# Altium schematic sheet DC-DC.SchDoc
size A2
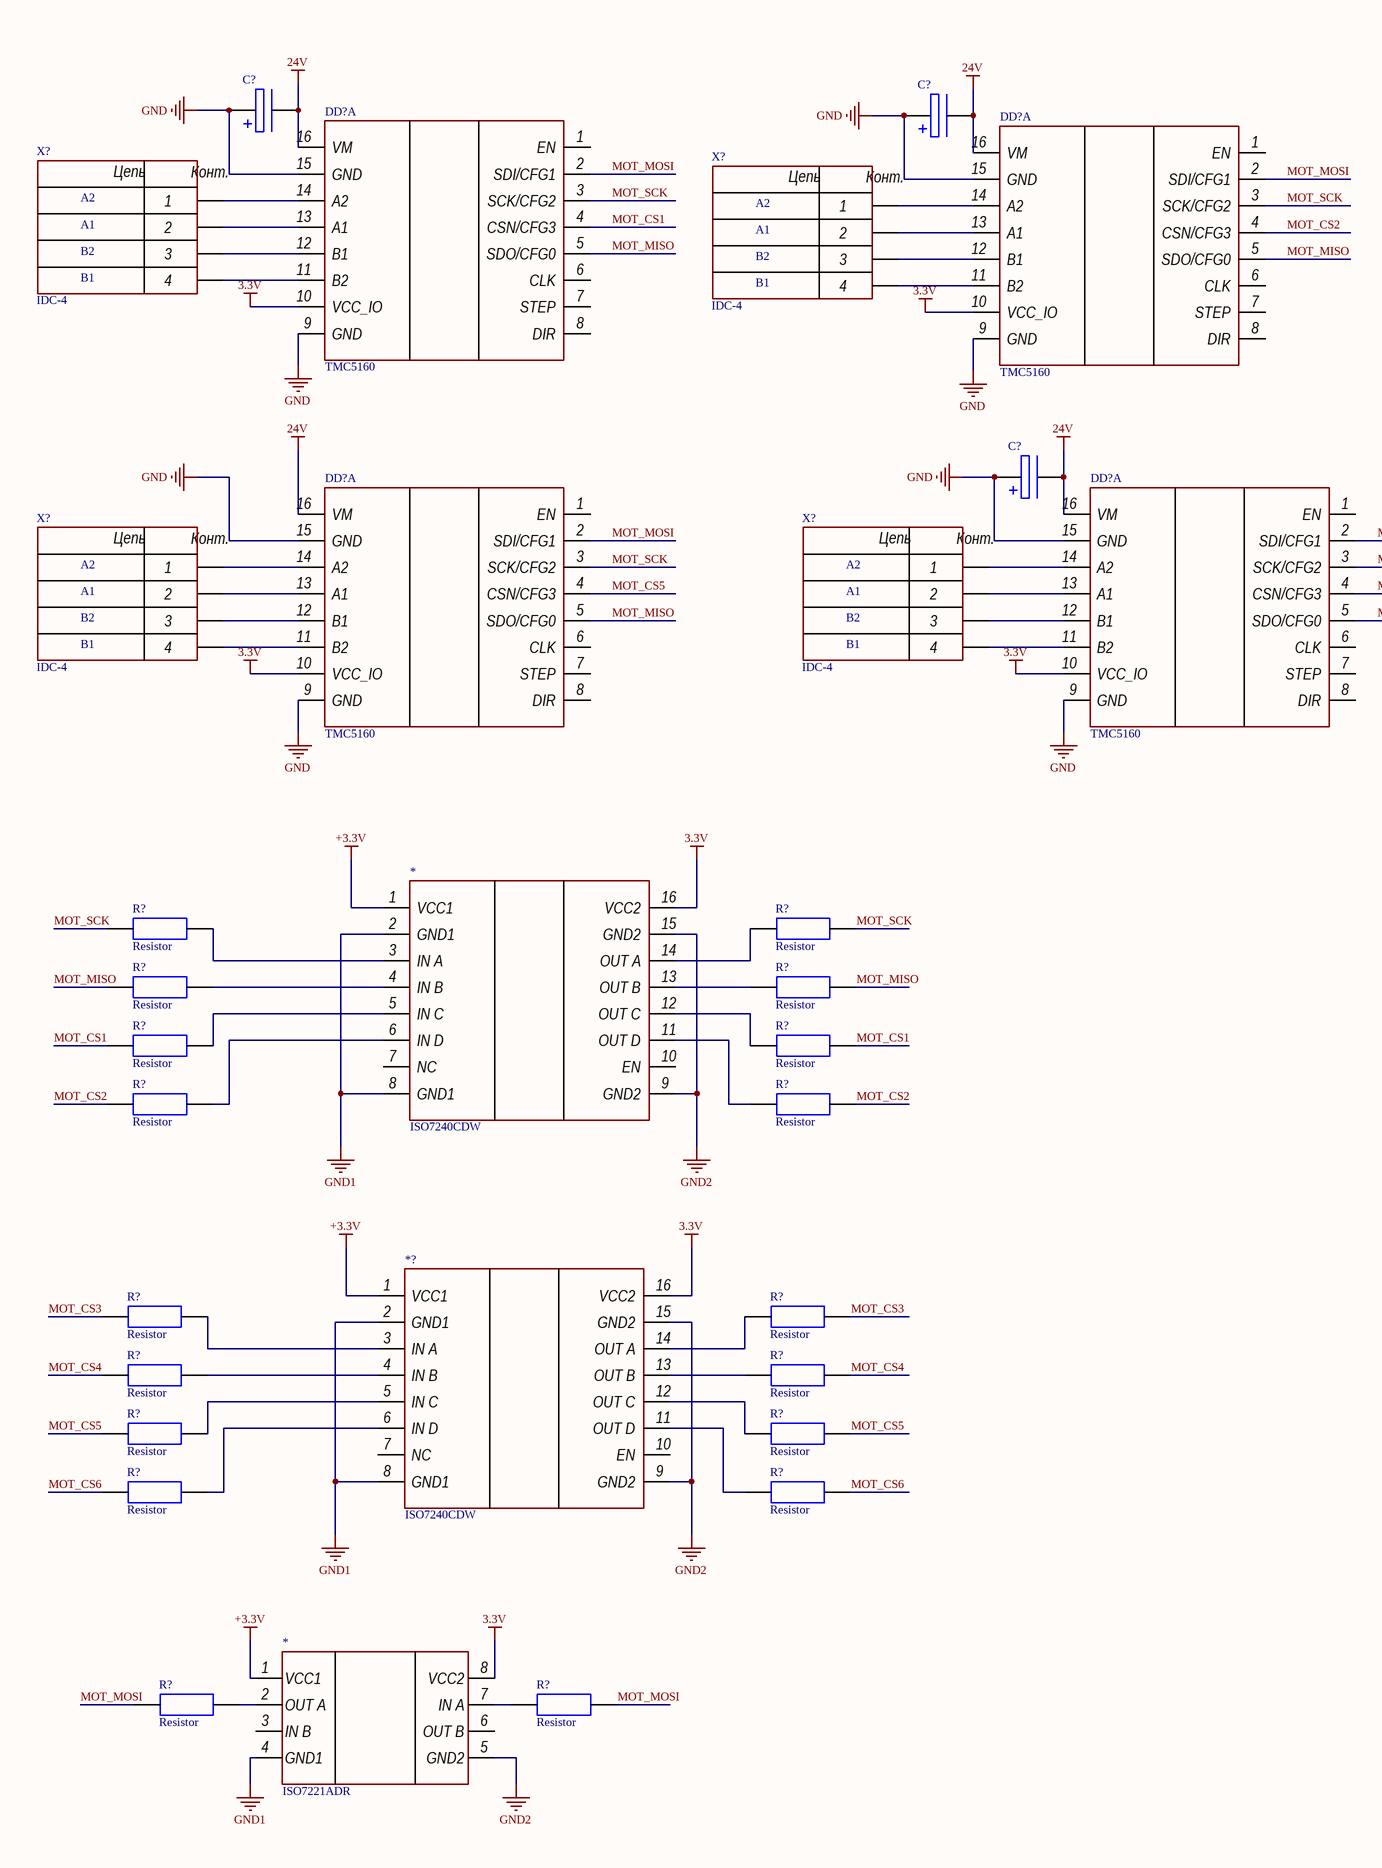
[diagram p0: DC-DC.SchDoc, left]
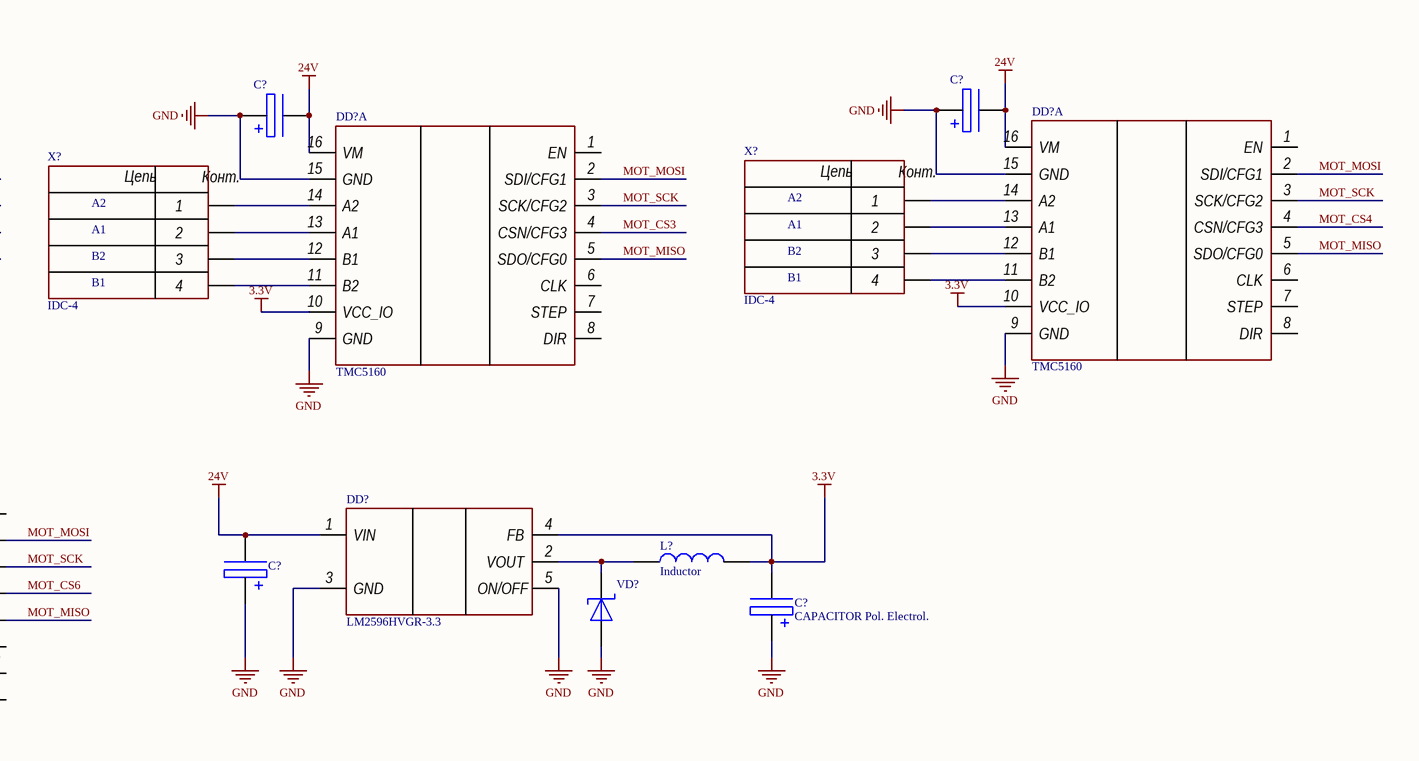
[diagram p1: DC-DC.SchDoc, right]

## Parts
(Parts that share a designator on the sheet are numbered #1, #2 ... from top to bottom, then left to right.)
*#1  ISO7240CDW  [ISO7240CDW_SOIC127P1030X265-16N]
*#2  ISO7221ADR  [ISO7221ADR_SOIC127P599X175-8N]
*?  ISO7240CDW  [ISO7240CDW_SOIC127P1030X265-16N]
C?#1  CAPACITOR Pol. Electrol.  (value not drawn)
C?#2  CAPACITOR Pol. Electrol.  (value not drawn)
C?#3  CAPACITOR Pol. Electrol.  (value not drawn)
C?#4  CAPACITOR Pol. Electrol.  (value not drawn)
C?#5  CAPACITOR Pol. Electrol.  (value not drawn)
C?#6  CAPACITOR Pol. Electrol.  (value not drawn)
C?#7  CAPACITOR Pol. Electrol.
DD?#1  TMC5160  [TMC5160]  (part A of 2)
DD?#2  TMC5160  [TMC5160]  (part A of 2)
DD?#3  TMC5160  [TMC5160]  (part A of 2)
DD?#4  TMC5160  [TMC5160]  (part A of 2)
DD?#5  TMC5160  [TMC5160]  (part A of 2)
DD?#6  TMC5160  [TMC5160]  (part A of 2)
DD?#7  LM2596HVGR-3.3
L?  Inductor  [IND_LQH66SN330M03L]
R?#1  Resistor  [RES: 0805]
R?#2  Resistor  [RES: 0805]
R?#3  Resistor  [RES: 0805]
R?#4  Resistor  [RES: 0805]
R?#5  Resistor  [RES: 0805]
R?#6  Resistor  [RES: 0805]
R?#7  Resistor  [RES: 0805]
R?#8  Resistor  [RES: 0805]
R?#9  Resistor  [RES: 0805]
R?#10  Resistor  [RES: 0805]
R?#11  Resistor  [RES: 0805]
R?#12  Resistor  [RES: 0805]
R?#13  Resistor  [RES: 0805]
R?#14  Resistor  [RES: 0805]
R?#15  Resistor  [RES: 0805]
R?#16  Resistor  [RES: 0805]
R?#17  Resistor  [RES: 0805]
R?#18  Resistor  [RES: 0805]
VD?  Diode_Shottki  [SK54]  (value not drawn)
X?#1  IDC-4
X?#2  IDC-4
X?#3  IDC-4
X?#4  IDC-4
X?#5  IDC-4
X?#6  IDC-4

## Nets
3.3V: *#1.16(VCC2) *#2.8(VCC2) *?.16(VCC2) C?#7.2(PIN_2) DD?#1.10(VCC_IO) DD?#2.10(VCC_IO) DD?#3.10(VCC_IO) DD?#4.10(VCC_IO) DD?#5.10(VCC_IO) DD?#6.10(VCC_IO) DD?#7.4(FB) L?.2
24V: C?#1.2(PIN_2) C?#2.2(PIN_2) C?#3.2(PIN_2) C?#4.2(PIN_2) C?#5.2(PIN_2) C?#6.2(PIN_2) DD?#1.16(VM) DD?#2.16(VM) DD?#3.16(VM) DD?#4.16(VM) DD?#5.16(VM) DD?#6.16(VM) DD?#7.1(VIN)
+3.3V: *#1.1(VCC1) *#2.1(VCC1) *?.1(VCC1)
GND: C?#1.1(PIN_1) C?#2.1(PIN_1) C?#3.1(PIN_1) C?#4.1(PIN_1) C?#5.1(PIN_1) C?#6.1(PIN_1) C?#7.1(PIN_1) DD?#1.9(GND) DD?#1.15(GND) DD?#2.9(GND) DD?#2.15(GND) DD?#3.9(GND) DD?#3.15(GND) DD?#4.9(GND) DD?#4.15(GND) DD?#5.9(GND) DD?#5.15(GND) DD?#6.9(GND) DD?#6.15(GND) DD?#7.3(GND) DD?#7.5(ON/OFF) VD?.1(A)
GND1: *#1.2(GND1) *#1.8(GND1) *#2.4(GND1) *?.2(GND1) *?.8(GND1)
GND2: *#1.9(GND2) *#1.15(GND2) *#2.5(GND2) *?.9(GND2) *?.15(GND2)
MOT_CS1: DD?#1.4(CSN/CFG3) R?#5.1 R?#6.2
MOT_CS2: DD?#3.4(CSN/CFG3) R?#7.1 R?#8.2
MOT_CS3: DD?#4.4(CSN/CFG3) R?#9.1 R?#10.2
MOT_CS4: DD?#2.4(CSN/CFG3) R?#11.1 R?#12.2
MOT_CS5: DD?#5.4(CSN/CFG3) R?#13.1 R?#14.2
MOT_CS6: DD?#6.4(CSN/CFG3) R?#15.1 R?#16.2
MOT_MISO: DD?#1.5(SDO/CFG0) DD?#2.5(SDO/CFG0) DD?#3.5(SDO/CFG0) DD?#4.5(SDO/CFG0) DD?#5.5(SDO/CFG0) DD?#6.5(SDO/CFG0) R?#3.1 R?#4.2
MOT_MOSI: DD?#1.2(SDI/CFG1) DD?#2.2(SDI/CFG1) DD?#3.2(SDI/CFG1) DD?#4.2(SDI/CFG1) DD?#5.2(SDI/CFG1) DD?#6.2(SDI/CFG1) R?#17.1 R?#18.2
MOT_SCK: DD?#1.3(SCK/CFG2) DD?#2.3(SCK/CFG2) DD?#3.3(SCK/CFG2) DD?#4.3(SCK/CFG2) DD?#5.3(SCK/CFG2) DD?#6.3(SCK/CFG2) R?#1.1 R?#2.2
Net*#1_3: *#1.3(IN_A) R?#1.2
Net*#1_4: *#1.4(IN_B) R?#3.2
Net*#1_5: *#1.5(IN_C) R?#5.2
Net*#1_6: *#1.6(IN_D) R?#7.2
Net*#1_11: *#1.11(OUT_D) R?#8.1
Net*#1_12: *#1.12(OUT_C) R?#6.1
Net*#1_13: *#1.13(OUT_B) R?#4.1
Net*#1_14: *#1.14(OUT_A) R?#2.1
Net*#2_2: *#2.2(OUT_A) R?#17.2
Net*#2_7: *#2.7(IN_A) R?#18.1
Net*?_3: *?.3(IN_A) R?#9.2
Net*?_4: *?.4(IN_B) R?#11.2
Net*?_5: *?.5(IN_C) R?#13.2
Net*?_6: *?.6(IN_D) R?#15.2
Net*?_11: *?.11(OUT_D) R?#16.1
Net*?_12: *?.12(OUT_C) R?#14.1
Net*?_13: *?.13(OUT_B) R?#12.1
Net*?_14: *?.14(OUT_A) R?#10.1
NetDD?#1_11: DD?#1.11(B2) X?#1.4
NetDD?#1_12: DD?#1.12(B1) X?#1.3
NetDD?#1_13: DD?#1.13(A1) X?#1.2
NetDD?#1_14: DD?#1.14(A2) X?#1.1
NetDD?#2_11: DD?#2.11(B2) X?#2.4
NetDD?#2_12: DD?#2.12(B1) X?#2.3
NetDD?#2_13: DD?#2.13(A1) X?#2.2
NetDD?#2_14: DD?#2.14(A2) X?#2.1
NetDD?#3_11: DD?#3.11(B2) X?#3.4
NetDD?#3_12: DD?#3.12(B1) X?#3.3
NetDD?#3_13: DD?#3.13(A1) X?#3.2
NetDD?#3_14: DD?#3.14(A2) X?#3.1
NetDD?#4_11: DD?#4.11(B2) X?#4.4
NetDD?#4_12: DD?#4.12(B1) X?#4.3
NetDD?#4_13: DD?#4.13(A1) X?#4.2
NetDD?#4_14: DD?#4.14(A2) X?#4.1
NetDD?#5_11: DD?#5.11(B2) X?#5.4
NetDD?#5_12: DD?#5.12(B1) X?#5.3
NetDD?#5_13: DD?#5.13(A1) X?#5.2
NetDD?#5_14: DD?#5.14(A2) X?#5.1
NetDD?#6_11: DD?#6.11(B2) X?#6.4
NetDD?#6_12: DD?#6.12(B1) X?#6.3
NetDD?#6_13: DD?#6.13(A1) X?#6.2
NetDD?#6_14: DD?#6.14(A2) X?#6.1
NetDD?#7_2: DD?#7.2(VOUT) L?.1 VD?.2(K)

Not connected (* = marked no-connect by the designer): *#1 7(NC) 10(EN); *#2 3(IN_B) 6(OUT_B); *? 7(NC) 10(EN); DD?#1 1(EN) 6(CLK) 7(STEP) 8(DIR); DD?#2 1(EN) 6(CLK) 7(STEP) 8(DIR); DD?#3 1(EN) 6(CLK) 7(STEP) 8(DIR); DD?#4 1(EN) 6(CLK) 7(STEP) 8(DIR); DD?#5 1(EN) 6(CLK) 7(STEP) 8(DIR); DD?#6 1(EN) 6(CLK) 7(STEP) 8(DIR)

## Notes on the sheet
- A2
- A1
- B2
- B1
- (in symbol IDC-4) Цепь; Конт.